# EAGLE design mhyh (EAGLE 6.5.0)
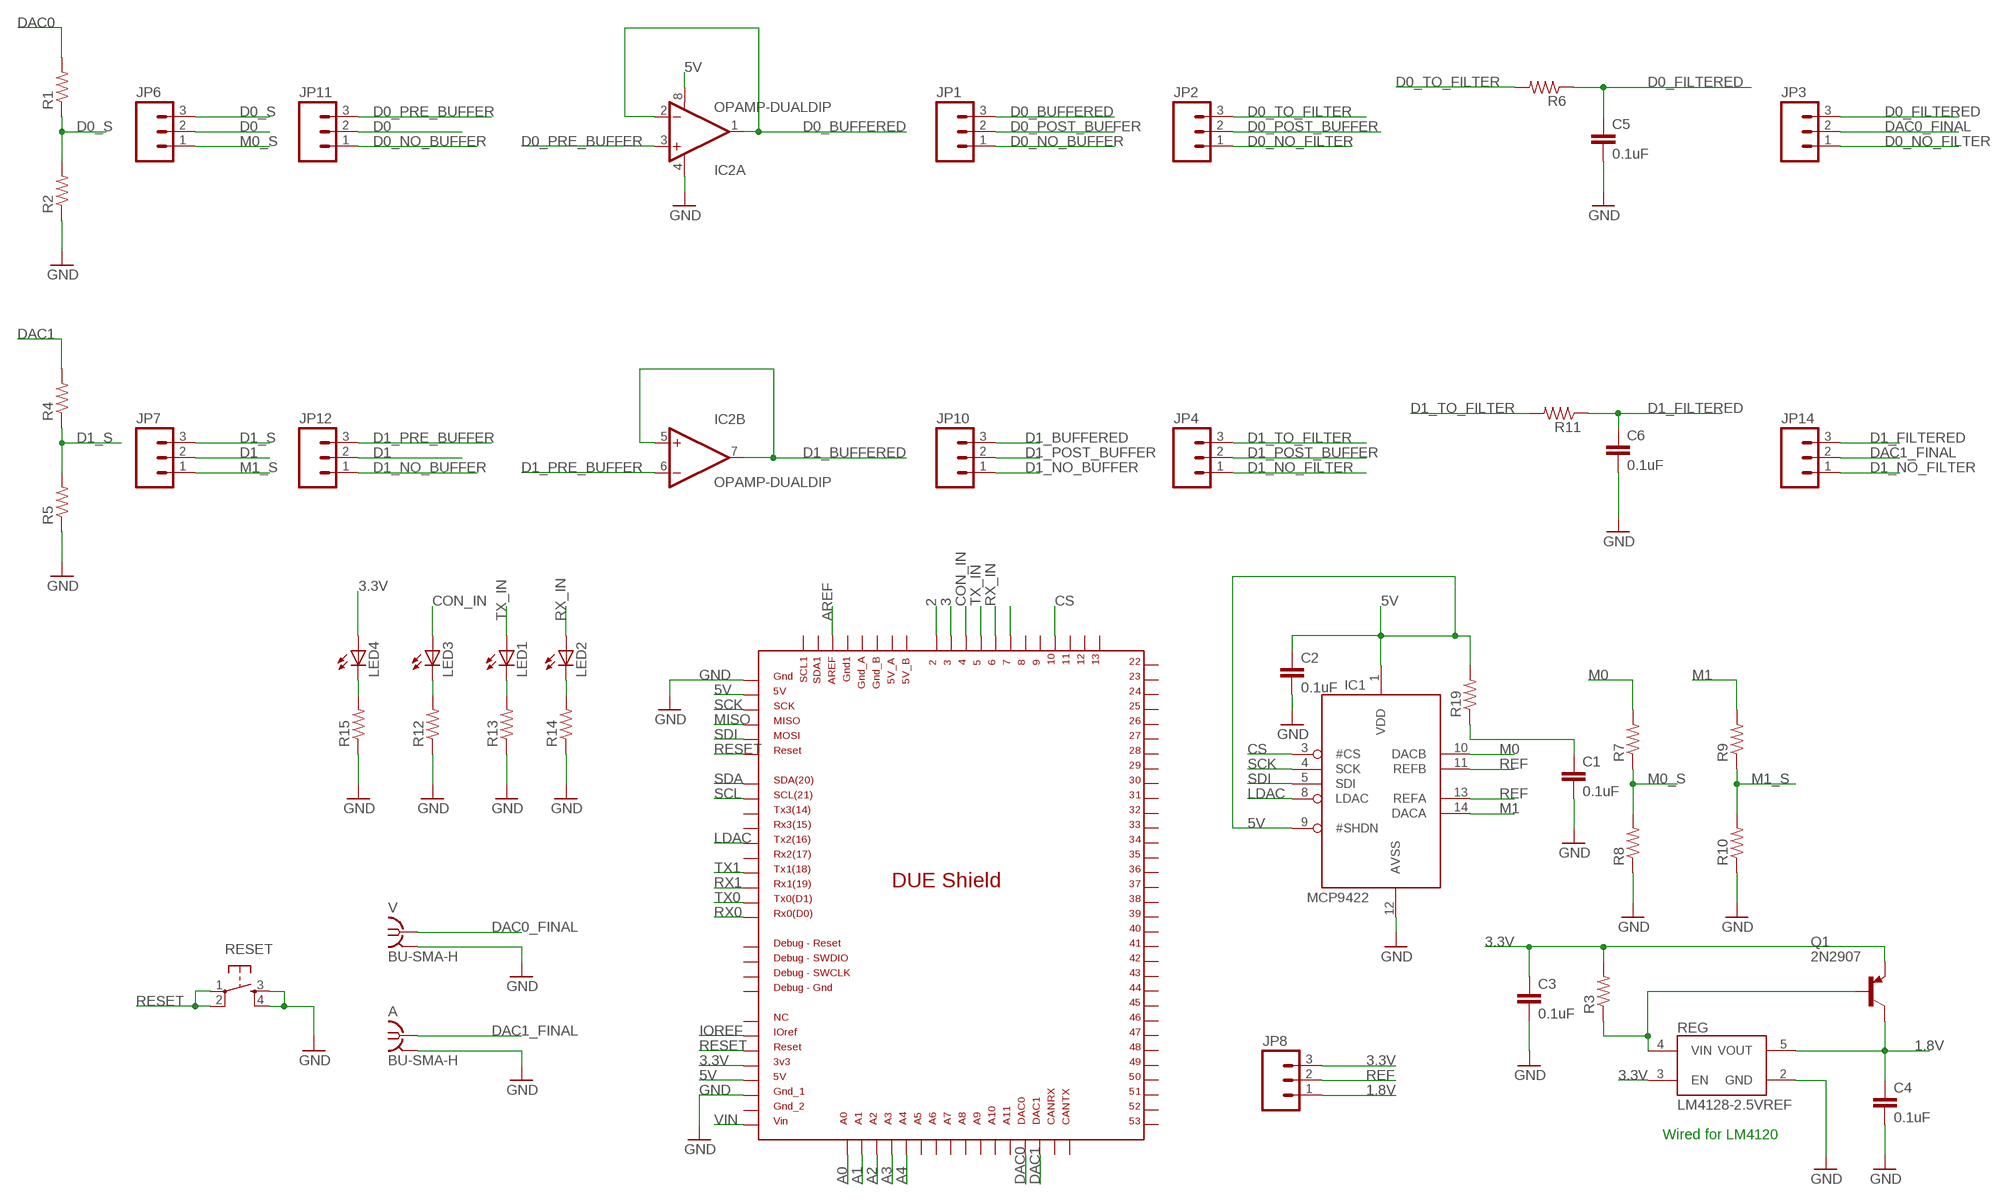
[diagram p0: schematic, sheet 1]

## Parts
A  BU-SMA-H  [BU-SMA-H]
C1  0.1uF  0.1UF-25V-5%(0603)  [0603-CAP]
C2  0.1uF  0.1UF-25V-5%(0603)  [0603-CAP]
C3  0.1uF  0.1UF-25V-5%(0603)  [0603-CAP]
C4  0.1uF  0.1UF-25V-5%(0603)  [0603-CAP]
C5  0.1uF  0.1UF-25V-5%(0603)  [0603-CAP]
C6  0.1uF  0.1UF-25V-5%(0603)  [0603-CAP]
IC1  MCP9422  [DIL14]
IC2  OPAMP-DUALDIP  [DIP08]
JP1  M03LOCK  [1X03_LOCK]
JP2  M03LOCK  [1X03_LOCK]
JP3  M03LOCK  [1X03_LOCK]
JP4  M03LOCK  [1X03_LOCK]
JP6  M03LOCK  [1X03_LOCK]
JP7  M03LOCK  [1X03_LOCK]
JP8  M03LOCK  [1X03_LOCK]
JP10  M03LOCK  [1X03_LOCK]
JP11  M03LOCK  [1X03_LOCK]
JP12  M03LOCK  [1X03_LOCK]
JP14  M03LOCK  [1X03_LOCK]
LED1  LEDCHIPLED_0603  [CHIPLED_0603]
LED2  LEDCHIPLED_0603  [CHIPLED_0603]
LED3  LEDCHIPLED_0603  [CHIPLED_0603]
LED4  LEDCHIPLED_0603  [CHIPLED_0603]
Q1  2N2907  [TO92-EBC-OVAL]
R1  RESISTOR0603-RES  [0603-RES]
R2  RESISTOR0603-RES  [0603-RES]
R3  RESISTOR0603-RES  [0603-RES]
R4  RESISTOR0603-RES  [0603-RES]
R5  RESISTOR0603-RES  [0603-RES]
R6  RESISTOR0603-RES  [0603-RES]
R7  RESISTOR0603-RES  [0603-RES]
R8  RESISTOR0603-RES  [0603-RES]
R9  RESISTOR0603-RES  [0603-RES]
R10  RESISTOR0603-RES  [0603-RES]
R11  RESISTOR0603-RES  [0603-RES]
R12  RESISTOR0603-RES  [0603-RES]
R13  RESISTOR0603-RES  [0603-RES]
R14  RESISTOR0603-RES  [0603-RES]
R15  RESISTOR0603-RES  [0603-RES]
R19  RESISTOR0603-RES  [0603-RES]
REG  LM4128-2.5VREF  [SOT23-5]
RESET  TAC_SWITCHPTH  [TACTILE-PTH]
U$1  DUE(NORMAL)  [DUE(NORMAL)]
V  BU-SMA-H  [BU-SMA-H]

## Nets
1.8V: C4.1 JP8.1 Q1.C REG.5(VOUT)
2: U$1.2
3: U$1.3
3.3V: C3.1 JP8.3 LED4.A Q1.E R3.2 REG.3(EN) U$1.3V3
5V: C2.1 IC1.1(VDD) IC1.9(#SHDN) IC2.8(A:V+) R19.2 U$1.5V U$1.GND_ICSP
A0: U$1.A0
A1: U$1.A1
A2: U$1.A2
A3: U$1.A3
A4: U$1.A4
AREF: U$1.AREF
CON_IN: LED3.A U$1.4
CS: IC1.3(#CS) U$1.10
D0: JP6.2 JP11.2
D0_BUFFERED: IC2.1(A:OUT) IC2.2(A:-IN) JP1.3
D0_FILTERED: C5.1 JP3.3 R6.1
D0_NO_BUFFER: JP1.1 JP11.1
D0_NO_FILTER: JP2.1 JP3.1
D0_POST_BUFFER: JP1.2 JP2.2
D0_PRE_BUFFER: IC2.3(A:+IN) JP11.3
D0_S: JP6.3 R1.1 R2.2
D0_TO_FILTER: JP2.3 R6.2
D1: JP7.2 JP12.2
D1_BUFFERED: IC2.5(B:+IN) IC2.7(B:OUT) JP10.3
D1_FILTERED: C6.1 JP14.3 R11.1
D1_NO_BUFFER: JP10.1 JP12.1
D1_NO_FILTER: JP4.1 JP14.1
D1_POST_BUFFER: JP4.2 JP10.2
D1_PRE_BUFFER: IC2.6(B:-IN) JP12.3
D1_S: JP7.3 R4.1 R5.2
D1_TO_FILTER: JP4.3 R11.2
DAC0: R1.2 U$1.DAC0
DAC0_FINAL: JP3.2 V.1
DAC1: R4.2 U$1.DAC1
DAC1_FINAL: A.1 JP14.2
GND: A.2 A.3 A.4 A.5 C1.2 C2.2 C3.2 C4.2 C5.2 C6.2 IC1.12(AVSS) IC2.4(A:V-) R2.1 R5.1 R8.1 R10.1 R12.1 R13.1 R14.1 R15.1 REG.2(GND) RESET.3 RESET.4 U$1.5V_ICSP U$1.GND_1 V.2 V.3 V.4 V.5
IOREF: U$1.IOREF
LDAC: IC1.8(LDAC) U$1.TX2
M0: IC1.10(DACB) R7.2
M0_S: JP6.1 R7.1 R8.2
M1: IC1.14(DACA) R9.2
M1_S: JP7.1 R9.1 R10.2
MISO: U$1.MISO_ICSP
N$1: Q1.B R3.1 REG.4(VIN)
N$2: C1.1 R19.1
N$3: LED1.C R13.2
N$4: LED2.C R14.2
N$7: LED4.C R15.2
N$8: LED3.C R12.2
REF: IC1.11(REFB) IC1.13(REFA) JP8.2
RESET: RESET.1 RESET.2 U$1.RESET U$1.RESET_ICSP
RX0: U$1.RX0
RX1: U$1.RX1
RX_IN: LED2.A U$1.6
SCK: IC1.4(SCK) U$1.SCK_ICSP
SCL: U$1.SCL
SDA: U$1.SDA
SDI: IC1.5(SDI) U$1.MOSI_ICSP
SHDN: U$1.7
TX0: U$1.TX0
TX1: U$1.TX1
TX_IN: LED1.A U$1.5
VIN: U$1.VIN
Unconnected: U$1.5V_A U$1.5V_B U$1.8 U$1.9 U$1.11 U$1.12 U$1.13 U$1.22 U$1.23 U$1.24 U$1.25 U$1.26 U$1.27 U$1.28 U$1.29 U$1.30 U$1.31 U$1.32 U$1.33 U$1.34 U$1.35 U$1.36 U$1.37 U$1.38 U$1.39 U$1.40 U$1.41 U$1.42 U$1.43 U$1.44 U$1.45 U$1.46 U$1.47 U$1.48 U$1.49 U$1.50 U$1.51 U$1.52 U$1.53 U$1.A5 U$1.A6 U$1.A7 U$1.A8 U$1.A9 U$1.A10 U$1.A11 U$1.CANRX U$1.CANTX U$1.GND1 U$1.GND_2 U$1.GND_A U$1.GND_B U$1.GND_DEBUG U$1.NC U$1.RESET_DEBUG U$1.RX2 U$1.RX3 U$1.SCL1 U$1.SDA1 U$1.SWCLK_DEBUG U$1.SWDIO_DEBUG U$1.TX3

## Notes on the sheet
- Wired for LM4120

## Library data of the parts
A V = con-coax:BU-SMA-H: FEMALE SMA CONNECTOR Radiall; OC_FARNELL: unknown; OC_NEWARK: unknown
C1-C6 = SparkFun-Capacitors:0.1UF-25V-5%(0603): CAP-08604; PROD_ID: CAP-08604
IC1 = adafruit:MCP9422
IC2 = SparkFun-AnalogIC:OPAMP-DUAL: Generic op-amp footprint
JP1-JP4 JP6-JP8 JP10-JP12 JP14 = SparkFun-Connectors:M03: Header 3 Standard 3-pin 0.1" header. Use with straight break away headers (SKU : PRT-00116), right angle break away headers (PRT-00553), swiss pins (PRT-00743), machine pins (PRT-00117), and female headers (PRT-00115). Molex polarized connector foot print use with SKU : PRT-08232 with associated crimp pins and housings.
LED1-LED4 = adafruit:LED: LED OSRAM: - CHIPLED LG R971, LG N971, LY N971, LG Q971, LY Q971, LO R971, LY R971 LH N974, LH R974 LS Q976, LO Q976, LY Q976 LO Q996 - Hyper CHIPLED LW Q18S LB Q993, LB Q99A, LB R99A - SideLED LS A670, LO A670, LY A670, LG A670, LP A670 LB A673, LV A673, LT A673, LW A673 LH A674 LY A675 LS A676, LA A676, LO A676, LY A676, LW A676 LS A679, LY A679, LG A679 - Hyper Micro SIDELED® LS Y876, LA Y876, LO Y876, LY Y876 LT Y87S - SmartLED LW L88C, LW L88S LB L89C, LB L89S, LG L890 LS L89K, LO L89K, LY L89K LS L896, LA L896, LO L896, LY L896 - TOPLED LS T670, LO T670, LY T670, LG T670, LP T670 LSG T670, LSP T670, LSY T670, LOP T670, LYG T670 LG T671, LOG T671, LSG T671 LB T673, LV T673, LT T673, LW T673 LH T674 LS T676, LA T676, LO T676, LY T676, LB T676, LH T676, LSB T676, LW T676 LB T67C, LV T67C, LT T67C, LS T67K, LO T67K, LY T67K, LW E67C LS E67B, LA E67B, LO E67B, LY E67B, LB E67C, LV E67C, LT E67C LW T67C LS T679, LY T679, LG T679 LS T770, LO T770, LY T770, LG T770, LP T770 LB T773, LV T773, LT T773, LW T773 LH T774 LS E675, LA E675, LY E675, LS T675 LS T776, LA T776, LO T776, LY T776, LB T776 LHGB T686 LT T68C, LB T68C - Hyper Mini TOPLED® LB M676 - Mini TOPLED Santana® LG M470 LS M47K, LO M47K, LY M47K Source: http://www.osram.convergy.de/
Q1 = adafruit:2N2907*: PNP Transistor Big Oval pads
R1-R15 R19 = SparkFun-Passives:RESISTOR: Resistor Basic schematic elements and footprints for 0603, 1206, and PTH resistors.
REG = SparkFun-PowerIC:LM4128-2.5VREF: .1% accurate low-current voltage reference
RESET = SparkFun-Electromechanical:TAC_SWITCH: Momentary Switch Button commonly used for reset or general input. Spark Fun Electronics SKU : COM-00097 SMT- SWCH-08247
U$1 = DUElib130425 (1):DUE(NORMAL)

## Board
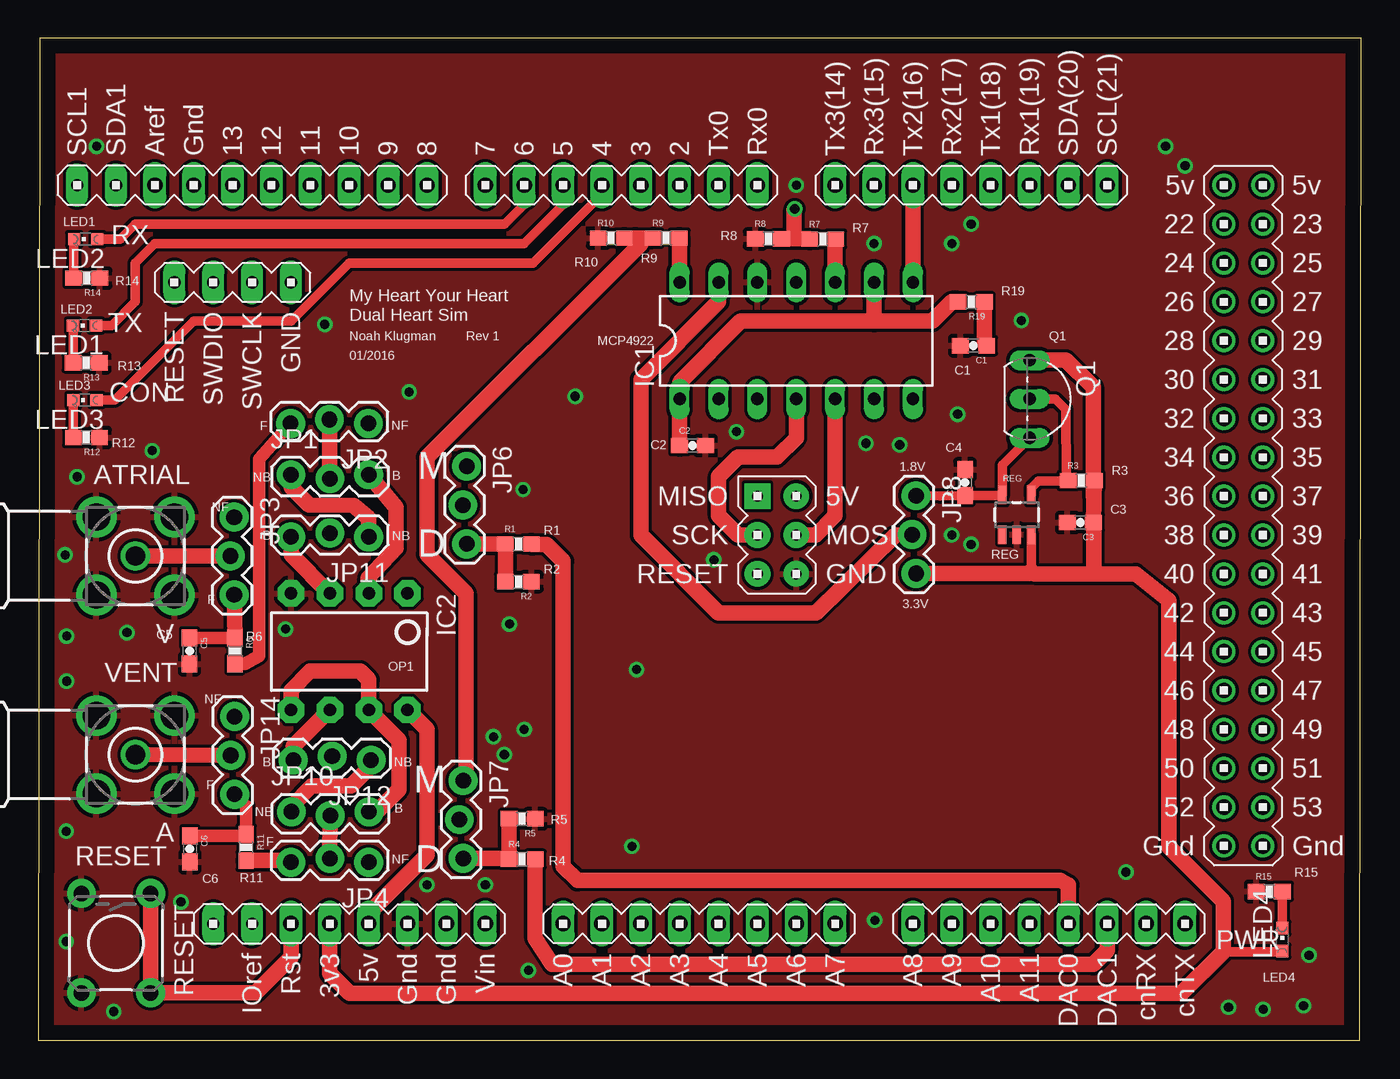
[diagram p1: board, top side]
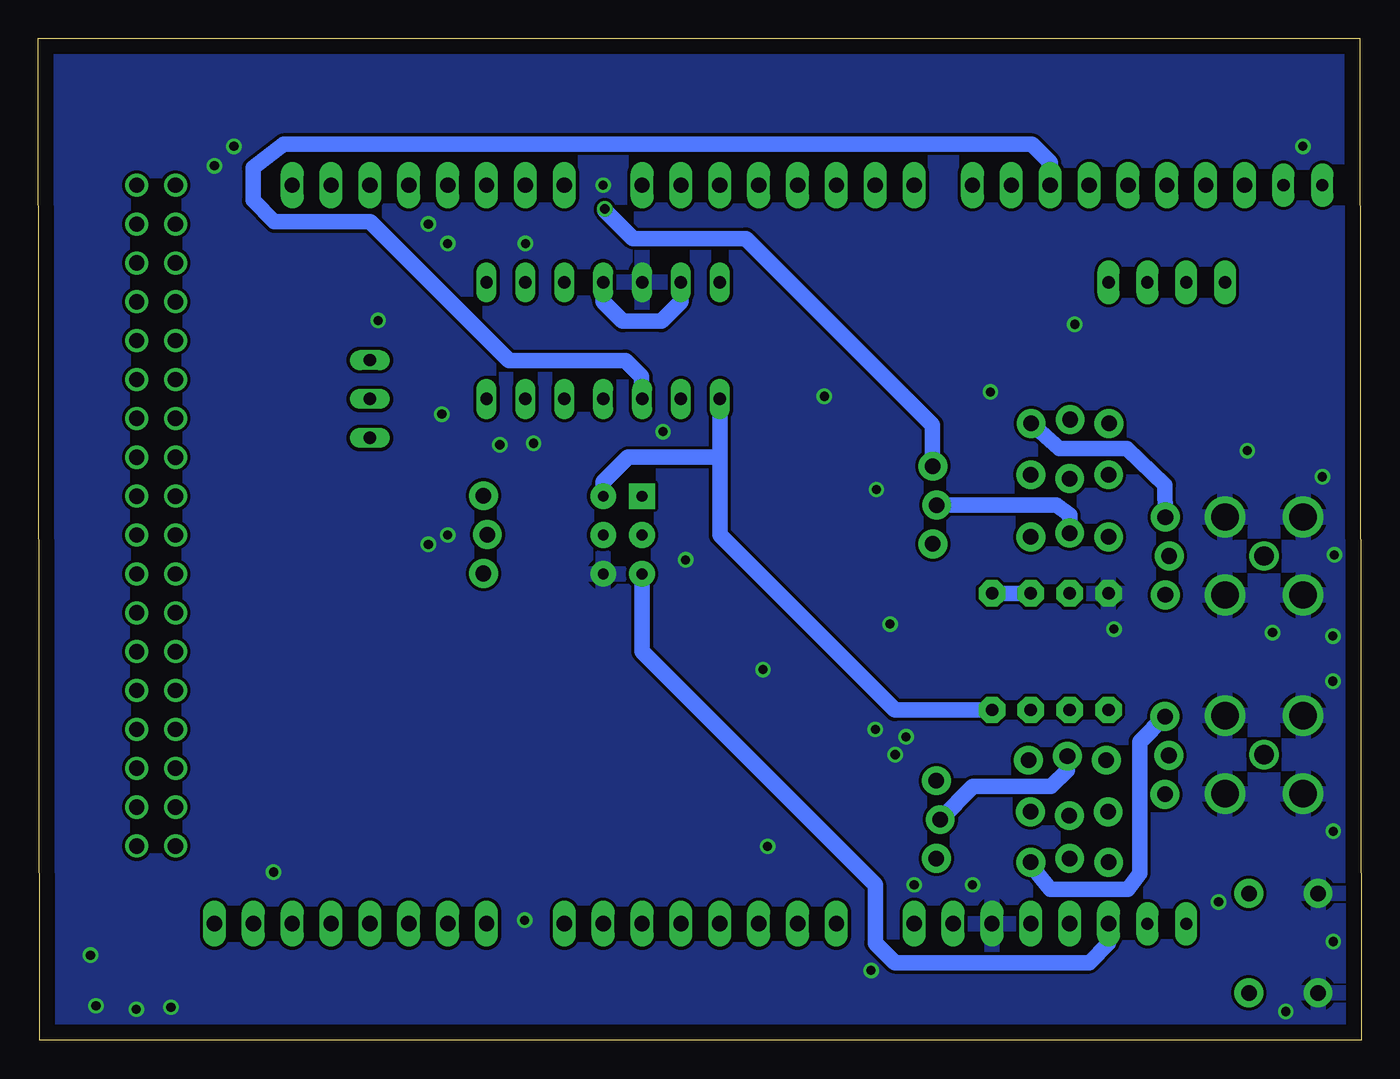
[diagram p2: board, bottom side, seen from below]

Size 86.44 x 65.48 mm. Coordinates in mm from the lower left corner, seen from the top.
Outline: 0,0 86.34,0 86.44,65.48 0.1,65.48 0,0
Copper layers (1*16): Top 0.035mm / dielectric 1.5mm / Bottom 0.035mm
Design rules "default *": minimum track width 10mil, minimum drill 24mil, track to track 8mil, track to pad 8mil, pad to pad 8mil, via to via 8mil, smd to smd 8mil, copper to edge 40mil, drill to drill 8mil, minimum pad ring 10mil, minimum via ring 8mil, stop-mask expansion 4mil, vias tented up to drill 40mil, thermal gap 10mil

### Footprints (pad centres in the part's own frame; a part is rotated, then mirrored left to right if it is on the bottom)
BU-SMA-H = drill 1.27: 1 0,0 | drill 1.778: 2 -2.55,2.55; 3 2.55,2.55; 4 2.55,-2.55; 5 -2.55,-2.55
0603-CAP = smd 1.1 x 1: 1 -0.85,0; 2 0.85,0
DIL14 = drill 0.813 long: 1 -7.62,-3.81; 2 -5.08,-3.81; 3 -2.54,-3.81; 4 0,-3.81; 5 2.54,-3.81; 6 5.08,-3.81; 7 7.62,-3.81; 8 7.62,3.81; 9 5.08,3.81; 10 2.54,3.81; 11 0,3.81; 12 -2.54,3.81; 13 -5.08,3.81; 14 -7.62,3.81
DIP08 = drill 0.813 pad 1.727 octagon: 1 -3.81,-3.81; 2 -1.27,-3.81; 3 1.27,-3.81; 4 3.81,-3.81; 5 3.81,3.81; 6 1.27,3.81; 7 -1.27,3.81; 8 -3.81,3.81
1X03_LOCK = drill 1.016 pad 1.88: 1 0,0.127; 2 2.54,-0.127; 3 5.08,0.127
CHIPLED_0603 = smd 0.8 x 0.8: A 0,-0.75; C 0,0.75
TO92-EBC-OVAL = drill 0.813 long: B 0,-1.27; C 2.54,-1.27; E -2.54,-1.27
0603-RES = smd 1.1 x 1: 1 -0.85,0; 2 0.85,0
SOT23-5 = smd 0.55 x 1.2: 1 -0.95,-1.3; 2 0,-1.3; 3 0.95,-1.3; 4 0.95,1.3; 5 -0.95,1.3
TACTILE-PTH = drill 1.016 pad 1.88: 1 -3.251,2.261; 2 3.251,2.261; 3 -3.251,-2.261; 4 3.251,-2.261
DUE(NORMAL) = drill 1 long: 2 -16.51,30.48; 3 -19.05,30.48; 3V3 -39.37,-17.78; 4 -21.59,30.48; 5 -24.13,30.48; 5V -36.83,-17.78; 6 -26.67,30.48; 7 -29.21,30.48; 8 -33.02,30.48; 9 -35.56,30.48; 10 -38.1,30.48; 11 -40.64,30.48; 12 -43.18,30.48; 13 -45.72,30.48; A0 -24.13,-17.78; A1 -21.59,-17.78; A2 -19.05,-17.78; A3 -16.51,-17.78; A4 -13.97,-17.78; A5 -11.43,-17.78; A6 -8.89,-17.78; A7 -6.35,-17.78; A8 -1.27,-17.78; A9 1.27,-17.78; A10 3.81,-17.78; A11 6.35,-17.78; AREF -50.8,30.48; AREF1 -50.8,30.48; CANRX 13.97,-17.78; CANTX 16.51,-17.78; DAC0 8.89,-17.78; DAC1 11.43,-17.78; GND1 -48.26,30.48; GND_1 -34.29,-17.78; GND_2 -31.75,-17.78; RESET -41.91,-17.78; RX0 -11.43,30.48; RX1 6.35,30.48; RX2 1.27,30.48; RX3 -3.81,30.48; SCL 11.43,30.48; SDA 8.89,30.48; TX0 -13.97,30.48; TX1 3.81,30.48; TX2 -1.27,30.48; TX3 -6.35,30.48; VIN -29.21,-17.78 | drill 1: 5V_A 19.05,30.48; 5V_B 21.59,30.48; 22 19.05,27.94; 23 21.59,27.94; 24 19.05,25.4; 25 21.59,25.4; 26 19.05,22.86; 27 21.59,22.86; 28 19.05,20.32; 29 21.59,20.32; 30 19.05,17.78; 31 21.59,17.78; 32 19.05,15.24; 33 21.59,15.24; 34 19.05,12.7; 35 21.59,12.7; 36 19.05,10.16; 37 21.59,10.16; 38 19.05,7.62; 39 21.59,7.62; 40 19.05,5.08; 41 21.59,5.08; 42 19.05,2.54; 43 21.59,2.54; 44 19.05,0; 45 21.59,0; 46 19.05,-2.54; 47 21.59,-2.54; 48 19.05,-5.08; 49 21.59,-5.08; 50 19.05,-7.62; 51 21.59,-7.62; 52 19.05,-10.16; 53 21.59,-10.16; GND_A 19.05,-12.7; GND_B 21.59,-12.7 | drill 0.7 pad 1.676: 5V_ICSP -8.89,5.08; GND_ICSP -8.89,10.16; MOSI_ICSP -8.89,7.62; RESET_ICSP -11.43,5.08; SCK_ICSP -11.43,7.62 | drill 0.8 pad 1.422 long: GND_DEBUG -41.91,24.13; IOREF -44.45,-17.78; NC -46.99,-17.78; RESET_DEBUG -49.53,24.13; SCL1 -55.88,30.48; SDA1 -53.34,30.48; SWCLK_DEBUG -44.45,24.13; SWDIO_DEBUG -46.99,24.13 | drill 0.7 pad 1.676 square: MISO_ICSP -11.43,10.16

### Placement (x,y rotation side)
A  6.35,18.67 180 top
C1  61.11,45.39 180 top
C2  42.75,38.86 0 top
C3  68.1,33.83 180 top
C4  60.55,36.45 90 top
C5  9.88,25.45 270 top
C6  9.91,12.52 270 top
IC1  49.53,45.72 0 top
IC2  20.32,25.4 180 top
JP1  16.51,36.83 0 top
JP2  21.56,40.44 180 top
JP3  12.67,34.19 270 top
JP4  21.59,11.76 180 top
JP6  27.86,37.52 270 top
JP7  27.64,16.97 270 top
JP8  57.23,35.59 270 top
JP10  16.54,14.81 0 top
JP11  21.59,33.02 180 top
JP12  21.74,18.44 180 top
JP14  12.7,21.16 270 top
LED1  3.02,46.71 90 top
LED2  3.1,52.35 90 top
LED3  3.05,41.83 90 top
LED4  81.28,6.58 0 top
Q1  66.04,41.91 270 top
R1  31.37,32.44 0 top
R2  31.37,29.97 180 top
R3  68.15,36.58 0 top
R4  31.62,11.84 0 top
R5  31.62,14.48 180 top
R6  12.85,25.45 270 top
R7  51.26,52.35 0 top
R8  47.7,52.37 0 top
R9  41.02,52.43 0 top
R10  37.44,52.43 0 top
R11  13.59,12.6 270 top
R12  3.15,39.4 180 top
R13  3.12,44.27 180 top
R14  3.17,49.81 180 top
R15  80.44,9.73 0 top
R19  60.96,48.26 180 top
REG  63.93,34.34 0 top
RESET  5.08,6.35 270 top
U$1  58.42,25.4 0 top
V  6.35,31.65 180 top

### Tracks (layer width: path | path; a pad name or v marks a point on that pad's centre or on a via)
1.8V
  Top 0.61: JP8.1 58.91,35.56 C4.1 62.94,35.6 REG.5 62.98,37.58 Q1.C
3.3V
  Top 0.61: 77.42,5.79 81.24,5.79 LED4.A | REG.3 64.88,30.67 65.08,30.48
  Top 1.016: U$1.3V3 19.05,4.37 20.34,3.07 74.7,3.07 77.42,5.79 77.42,9.09 73.86,12.65 73.86,28.75 71.7,30.48 68.96,30.48 | 65.08,30.48 68.96,30.48 | 68.96,30.48 68.96,33.01 C3.1 R3.2 68.94,35.55 68.94,42.67 67.16,44.45 Q1.E | JP8.3 64.71,30.5 64.88,30.67
5V
  Top 1.016: C2.1 41.9,41.9 IC1.1 41.94,41.93 41.94,43.03 45.9,46.99 54.61,46.99 | R19.2 59.69,48.26 58.42,46.99 54.61,46.99 | 54.61,46.99 IC1.9 | IC2.8 25.4,20.32 25.4,12.12 21.61,8.33 21.61,7.64 U$1.5V
  Bottom 1.016: IC2.8 30.48,21.59 41.91,33.02 41.91,38.07 | 41.91,38.07 IC1.1 | U$1.GND_ICSP 49.53,36.47 47.9,38.1 41.94,38.1 41.91,38.07
CON_IN
  Top 0.61: LED3.A 5,41.83 10.16,46.99 16.51,46.99 20.32,50.8 32.33,50.8 36.85,55.32 36.85,55.85 U$1.4
CS
  Bottom 1.016: U$1.10 20.32,57.35 21.51,58.55 70.41,58.55 72.42,57.02 72.42,54.89 71.02,53.49 64.75,53.49 55.68,44.42 48.08,44.42 47.02,43.36 47.02,41.93 IC1.3
D0
  Bottom 1.016: JP11.2 19.05,34.31 19.91,34.98 JP6.2 28.17,34.98
D0_BUFFERED
  Top 1.016: IC2.2 21.57,30.23 23.37,32.16 23.37,34.82 JP1.3
  Bottom 1.016: IC2.2 IC2.1
D0_FILTERED
  Top 0.813: C5.1 R6.1
  Top 1.016: R6.1 JP3.3
D0_NO_BUFFER
  Top 1.016: JP1.1 16.51,36.17 17.7,34.98 20.6,34.95 21.59,34.14 JP11.1
D0_NO_FILTER
  Bottom 1.016: JP3.1 12.83,36.3 15.32,38.66 19.74,38.66 JP2.1
D0_POST_BUFFER
  Top 1.016: JP1.2 JP2.2
D0_PRE_BUFFER
  Top 1.016: IC2.3 16.51,31.75 JP11.3
D0_S
  Top 1.016: JP6.3 R1.1 R2.2
D0_TO_FILTER
  Top 0.813: R6.2 13.5,24.6 14.43,25.12 14.43,38 JP2.3
D1
  Bottom 1.016: JP12.2 19.2,17.63 20.27,16.59 25.38,16.59 JP7.2
D1_BUFFERED
  Top 1.016: IC2.5 16.51,22.86 17.78,24.13 21.03,24.13 21.59,23.57 IC2.7 23.57,19.61 23.57,16.41 22.23,15.06 JP10.3
D1_FILTERED
  Top 0.813: C6.1 13.51,13.37 R11.1 13.59,15.32 JP14.3
D1_NO_BUFFER
  Top 1.016: JP10.1 16.64,15.37 17.86,16.64 20.45,16.64 21.59,17.78 21.59,17.96 JP12.1
D1_NO_FILTER
  Bottom 1.016: JP4.1 21.61,11.46 20.32,9.88 15.24,9.88 14.48,10.92 14.48,19.51 JP14.1
D1_POST_BUFFER
  Top 1.016: JP4.2 19.07,14.71 JP10.2
D1_PRE_BUFFER
  Top 1.016: JP12.3 16.66,19.2 IC2.6
D1_S
  Top 1.016: JP7.3 30.72,11.89 R4.1 R5.2
D1_TO_FILTER
  Top 1.016: R11.2 16.45,11.77 JP4.3
DAC0
  Top 1.016: U$1.DAC0 67.31,10.16 66.78,10.44 35.23,10.44 34.29,11.38 34.29,31.32 33.22,32.38 32.27,32.38 R1.2
DAC0_FINAL
  Top 1.016: V.1 JP3.2
DAC1
  Top 1.016: U$1.DAC1 69.85,5.87 68.94,4.95 33.58,4.95 32.46,6.65 32.46,11.83 R4.2
DAC1_FINAL
  Top 1.016: A.1 JP14.2
GND  (via drill 0.6)
  other vias: 16.15,26.87 9.32,9.04 29.74,19.84 31.75,20.32 30.45,18.67 25.4,10.16 1.83,6.45 1.83,13.67 4.93,1.88 1.85,26.42 18.72,46.79 1.85,23.47 1.75,31.72 56.29,38.91 54.08,39.01 60.96,32.41 59.69,33.02 29.21,10.16 32.03,4.57 54.61,52.07 59.69,52.07 49.53,55.88 73.66,58.42 74.93,57.15 60.96,53.34 3.81,58.42 2.54,36.83 7.44,38.53 45.62,39.78 44.15,31.39 39.09,24.23 30.78,27.2 31.67,35.99 24.23,42.37 54.66,7.85 38.79,12.67 80.04,2.03 71.07,11 5.79,26.64 35.08,42.09 60.07,40.92 64.24,47.04 77.77,2.16 82.68,2.26 83.03,5.56
  pour Top: 0,66.04 86.36,66.04 86.36,0 0,0
  pour Bottom: 0,66.04 86.36,66.04 86.36,0 0,0
LDAC
  Top 1.016: IC1.8 U$1.TX2
M0
  Top 1.016: IC1.10 52.07,52.31 R7.2
M0_S  (via drill 0.6)
  Top 1.016: R7.1 50.36,52.38 R8.2 49.33,52.38 49.38,52.43 49.38,54.28 v49.43,54.33
  Bottom 1.016: v49.43,54.33 49.43,54.25 47.57,52.4 40.21,52.4 28.02,40.21 28.02,37.54 JP6.1
M1
  Top 1.016: IC1.14 41.91,52.39 R9.2
M1_S
  Top 1.016: R9.1 R10.2 39.01,52.43 39.37,52.07 25.4,38.1 25.4,31.75 27.94,29.21 27.94,17.14 JP7.1
N$1
  Top 0.61: Q1.B 66.47,41.91 67.16,41.22 67.18,36.69 R3.1 67.27,36.55 65.35,36.55 64.88,36.08 REG.4
N$2
  Top 1.016: R19.1 61.81,45.54 C1.1
N$3
  Top 0.61: R13.2 LED1.C
N$4
  Top 0.61: R14.2 2.33,52.33 LED2.C
N$7
  Top 0.61: LED4.C 81.28,9.72 R15.2
N$8
  Top 0.61: R12.2 LED3.C
REF
  Top 1.016: JP8.2 56.01,33.02 50.8,27.94 44.45,27.94 39.37,33.02 39.37,43.18 44.45,48.26 IC1.13
  Bottom 1.016: IC1.13 44.45,48.26 45.72,46.99 48.26,46.99 49.53,48.26 IC1.11
RESET
  Top 1.016: U$1.RESET 16.51,5.41 14.2,3.1 RESET.2 RESET.1
  Bottom 1.016: U$1.RESET_ICSP 46.99,25.4 31.75,10.16 31.75,6.35 30.48,5.08 17.78,5.08 16.51,6.35 U$1.RESET
RX_IN
  Top 0.61: LED2.A 5.36,52.35 6.35,53.34 30.48,53.34 31.75,54.61 U$1.6
SCK
  Top 1.016: U$1.SCK_ICSP 45.72,33.02 44.45,34.29 44.45,36.83 45.72,38.1 48.26,38.1 49.53,39.37 IC1.4
SDI
  Top 1.016: U$1.MOSI_ICSP 50.8,33.02 52.07,34.29 IC1.5
TX_IN
  Top 0.61: LED1.A 4.8,46.71 6.35,48.26 6.35,50.8 7.62,52.07 31.75,52.07 34.29,54.61 U$1.5

### Text on the board
tPlace: LED1 | R8 | R7 | RX | R10 | R9 | R14 | My Heart Your Heart | R19 | LED2 | TX | Dual Heart Sim | Noah Klugman | Rev 1 | MCP4922 | Q1 | 01/2016 | R13 | C1 | LED3 | CON | F | NF | R12 | C2 | C4 | ATRIAL | NB | B | M | 1.8V | R3 | NF | C3 | B | NB | R1 | D | REG | R2 | F | 3.3V | C5 | R6 | VENT | OP1 | NF | B | NB | F | M | NB | B | R5 | F | RESET | NF | R4 | C6 | R11 | D | R15 | PWR | LED4